# Altium project ESP32_LED_Matrix_Heirarchal.PrjPcb
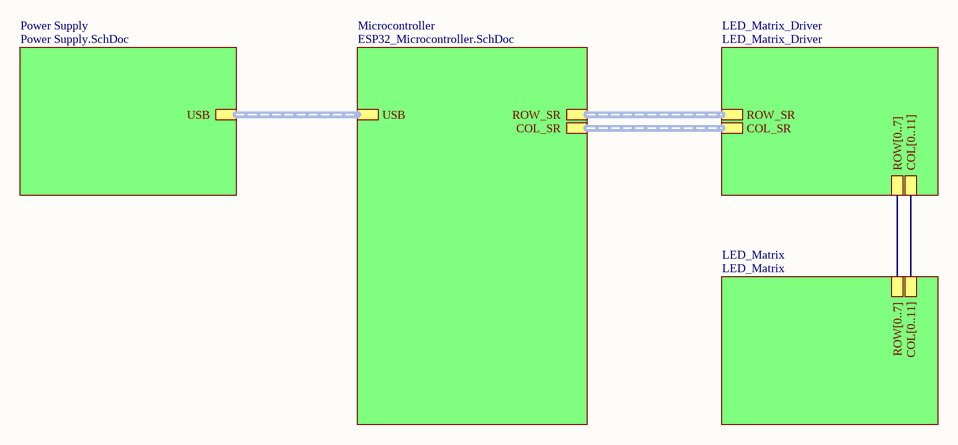
[diagram p0: ESP32_LED_Matrix.SchDoc]
3 sheets, 28 parts. Net scope: hierarchical (ports join the sheet entries above them; power ports are global).
Board files: ESP32_LED_Matrix_Completed.PcbDoc, ESP32_LED_Matrix_Partially_Unrouted.PcbDoc, ESP32_LED_Matrix_Unrouted.PcbDoc
Sheets:
  ESP32_LED_Matrix.SchDoc
    Power Supply = Power Supply.SchDoc
    Microcontroller = ESP32_Microcontroller.SchDoc

## Sheet ESP32_LED_Matrix.SchDoc
size A4; SheetNumber: 1; SheetTotal: 5

### Sub-sheets
LED_Matrix = LED_Matrix (file not in this document): COL[0..11], ROW[0..7]
LED_Matrix_Driver = LED_Matrix_Driver (file not in this document): COL_SR (harness COL_SR), ROW_SR (harness ROW_SR), ROW[0..7], COL[0..11]
Microcontroller = ESP32_Microcontroller.SchDoc: COL_SR (harness COL_SR), ROW_SR (harness ROW_SR), USB (harness USB)
Power Supply = Power Supply.SchDoc: USB (harness USB)

### Buses and harness runs
bus sheet LED_Matrix/COL[0..11] = sheet LED_Matrix_Driver/COL[0..11]
bus sheet LED_Matrix/ROW[0..7] = sheet LED_Matrix_Driver/ROW[0..7]
harness sheet LED_Matrix_Driver/COL_SR = sheet Microcontroller/COL_SR
harness sheet LED_Matrix_Driver/ROW_SR = sheet Microcontroller/ROW_SR
harness sheet Microcontroller/USB = sheet Power Supply/USB

## Sheet Power Supply.SchDoc
size A4; SheetNumber: 3; SheetTotal: 5
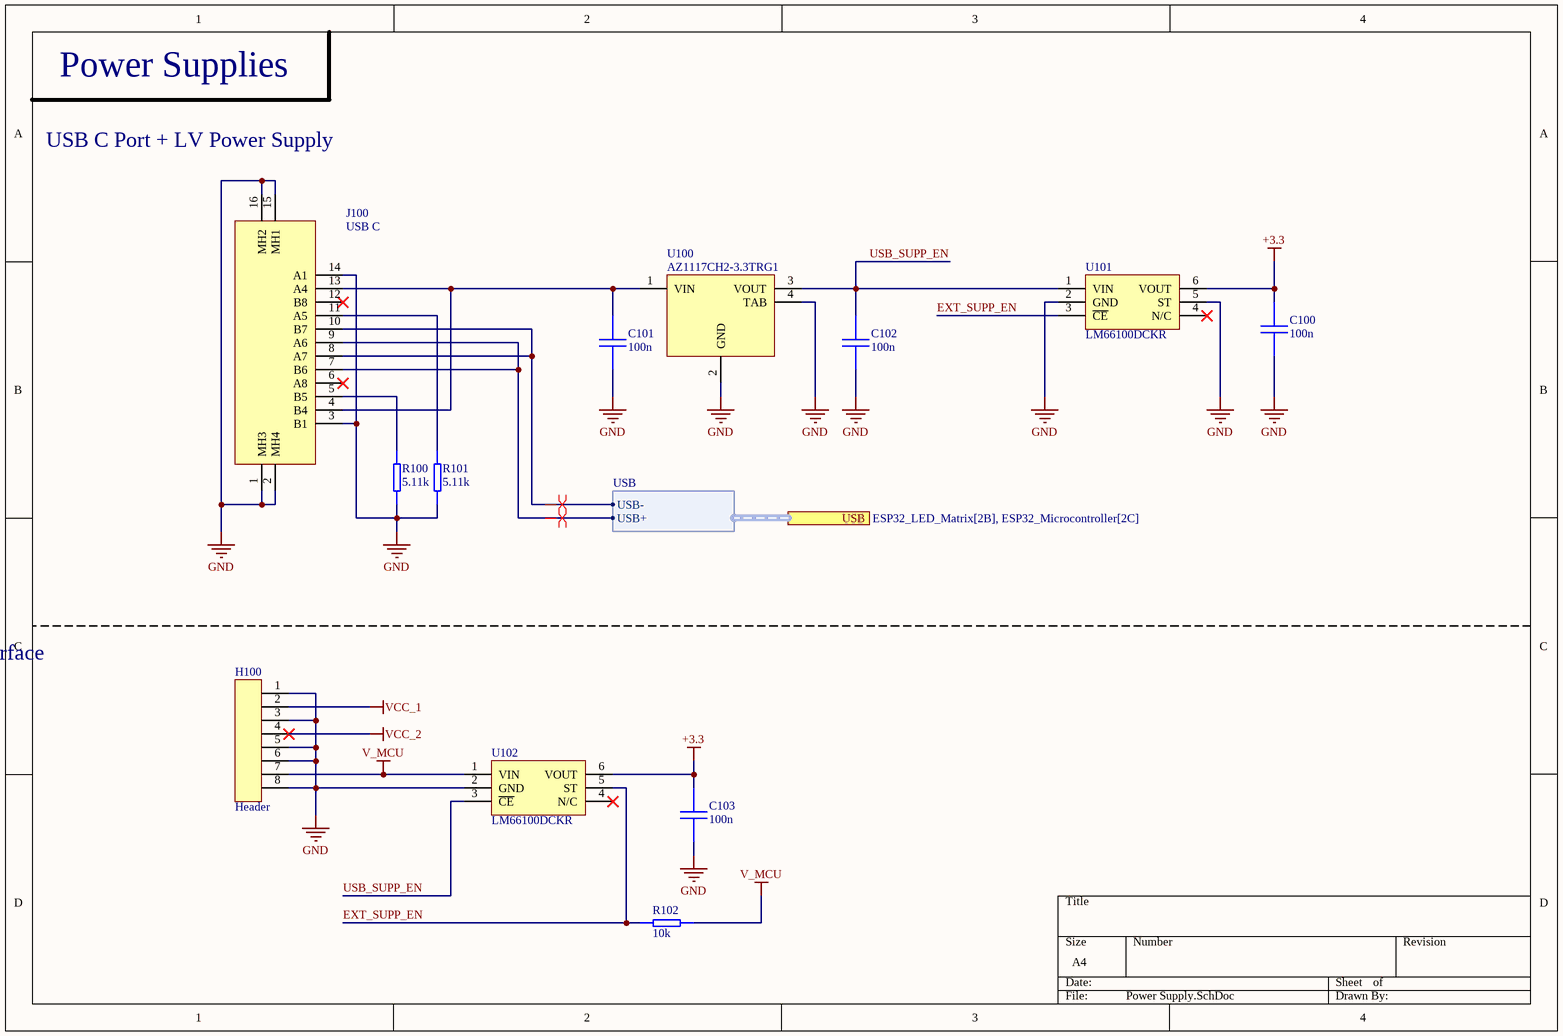
[diagram p1: Power Supply.SchDoc]

### Parts
C100  100n  [CAP0805]
C101  100n  [CAP0805]
C102  100n  [CAP0805]
C103  100n  [CAP0805]
H100  Header  [Header_1X8]
J100  USB C  [USB TYPE C 12 PIN]
R100  5.11k  [RESC0805]
R101  5.11k  [RESC0805]
R102  10k  [RESC0805]
U100  AZ1117CH2-3.3TRG1  [SOT223]
U101  LM66100DCKR  [SC70-6]
U102  LM66100DCKR  [SC70-6]

### Ports
USB (harness USB, see ESP32_LED_Matrix[2B], ESP32_Microcontroller[2C])

### Harnesses
USB: USB-, USB+

### Nets
+3.3: C100.1 C103.1 U101.6(VOUT) U102.6(VOUT)
GND: C100.2 C101.2 C102.2 C103.2 H100.1 H100.3 H100.5 H100.6 H100.8 J100.1(MH3) J100.2(MH4) J100.3(B1) J100.14(A1) J100.15(MH1) J100.16(MH2) R100.1 R101.1 U100.2(GND) U100.4(TAB) U101.2(GND) U101.5(ST) U102.2(GND)
V_MCU: H100.7 R102.2 U102.1(VIN)
VCC_1: H100.2
VCC_2: H100.4
EXT_SUPP_EN: R102.1 U101.3(~{CE}) U102.5(ST)
USB_D_N: J100.8(A7) J100.10(B7) ; port USB.USB-
USB_D_P: J100.7(B6) J100.9(A6) ; port USB.USB+
USB_SUPP_EN: C102.1 U100.3(VOUT) U101.1(VIN) U102.3(~{CE})
NetC101_1: C101.1 J100.4(B4) J100.13(A4) U100.1(VIN)
NetJ100_5: J100.5(B5) R100.2
NetJ100_11: J100.11(A5) R101.2

Not connected (* = marked no-connect by the designer): J100 6(A8)* 12(B8)*; U101 4(N/C)*; U102 4(N/C)*

### Layout directives
differential pair: USB_D_N, USB_D_P

### Notes on the sheet
- Power Supplies
- USB C Port + LV Power Supply
- Power Interface

### Library data of the parts
C100-C103 = Capacitor - Non Polarized: Non Polarized Capacitor
H100 = 8-Pin Header: System: Connector
J100 = USB Type C Connector 12 Pin
R100-R102 = Resistor
U100 = AZ1117CH2-3.3TRG1_1: 3.3V Linear Voltage Regulator
U101 U102 = LM66100DCKR: 5.5-V, 1.5-A 79-mΩ, Low IQ Ideal Diode With Input Polarity Protection; Manufacturer_Name: Texas Instruments; Datasheet Link: http://www.ti.com/lit/gpn/LM66100; Height: 1.1mm; Manufacturer_Part_Number: LM66100DCKR; Mouser Part Number: 595-LM66100DCKR; Mouser Price/Stock: https://www.mouser.co.uk/ProductDetail/Texas-Instruments/LM66100DCKR?qs=vLWxofP3U2y2yPPrXoBBoA%3D%3D; Arrow Part Number: LM66100DCKR; Arrow Price/Stock: https://www.arrow.com/en/products/lm66100dckr/texas-instruments?region=nac

## Sheet ESP32_Microcontroller.SchDoc
size A4; SheetNumber: 2; SheetTotal: 5
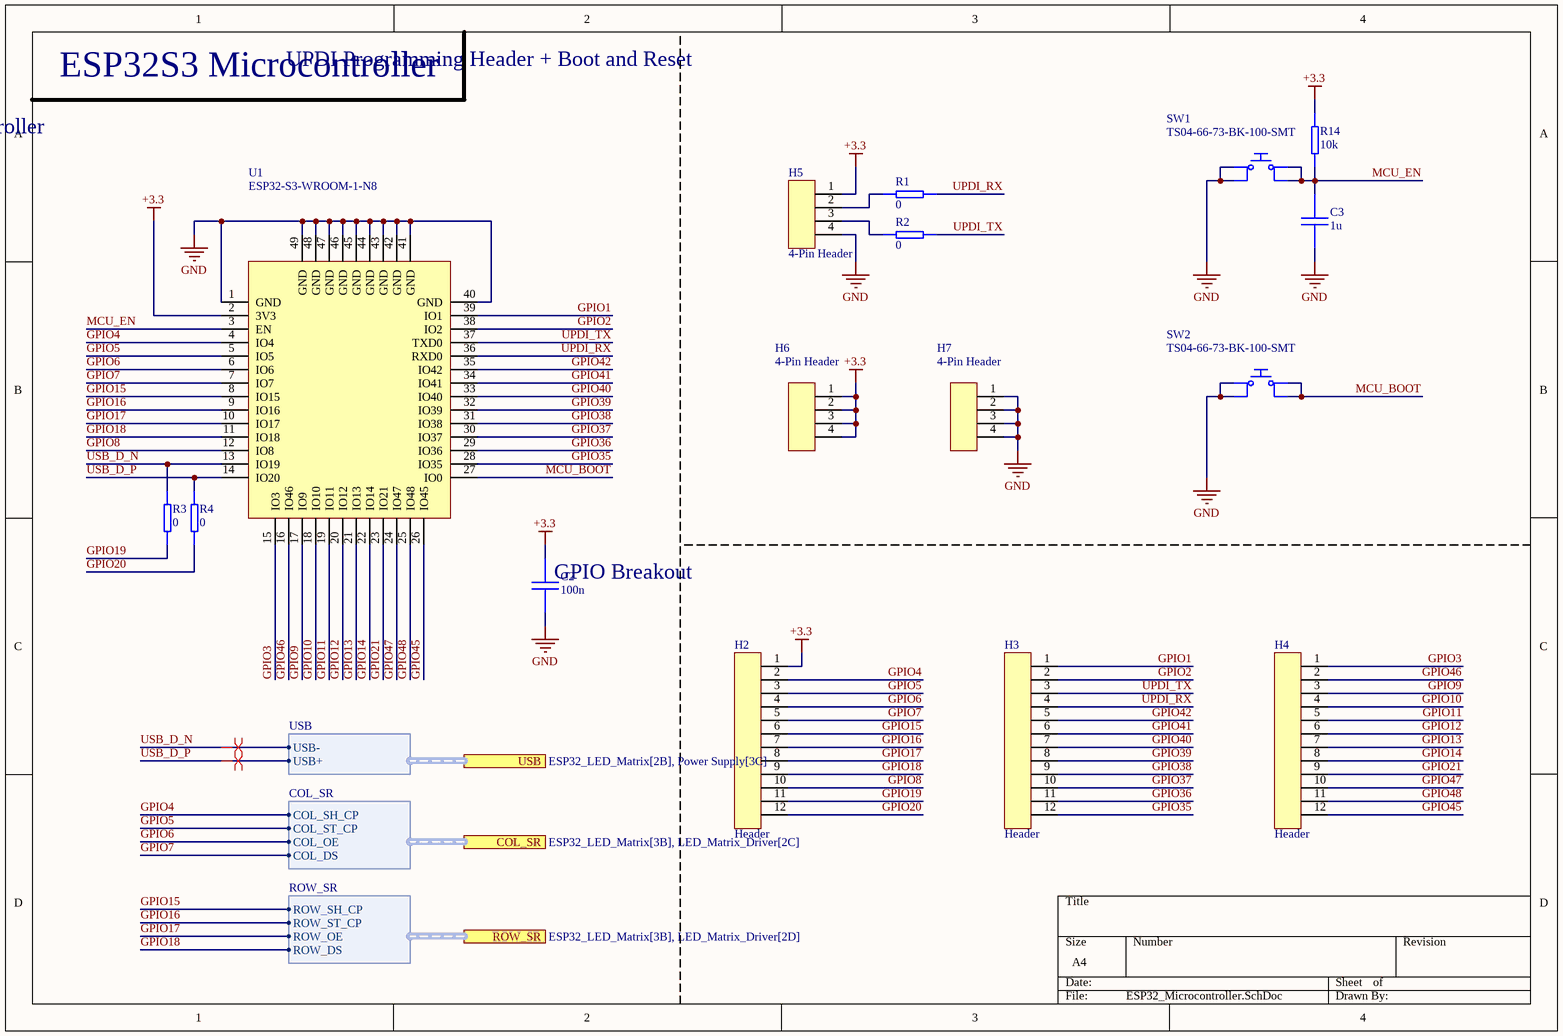
[diagram p2: ESP32_Microcontroller.SchDoc]

### Parts
C2  100n  [CAP0805]
C3  1u  [CAP0805]
H2  Header  [Header_1X12]
H3  Header  [Header_1X12]
H4  Header  [Header_1X12]
H5  4-Pin Header  [Header_1X4]
H6  4-Pin Header  [Header_1X4]
H7  4-Pin Header  [Header_1X4]
R1  0  [RESC0805]
R2  0  [RESC0805]
R3  0  [RESC0805]
R4  0  [RESC0805]
R14  10k  [RESC0805]
SW1  TS04-66-73-BK-100-SMT  [Tactile Button 6.0mm x 6.0mm]
SW2  TS04-66-73-BK-100-SMT  [Tactile Button 6.0mm x 6.0mm]
U1  ESP32-S3-WROOM-1-N8  [ESP32-S3-WROOM-1-N8]

### Ports
COL_SR (harness COL_SR, see ESP32_LED_Matrix[3B], LED_Matrix_Driver[2C]), ROW_SR (harness ROW_SR, see ESP32_LED_Matrix[3B], LED_Matrix_Driver[2D]), USB (harness USB, see ESP32_LED_Matrix[2B], Power Supply[3C])

### Harnesses
COL_SR: COL_SH_CP, COL_ST_CP, COL_OE, COL_DS
ROW_SR: ROW_SH_CP, ROW_ST_CP, ROW_OE, ROW_DS
USB: USB-, USB+

### Nets
+3.3: C2.1 H2.1 H5.1 H6.1 H6.2 H6.3 H6.4 R14.1 U1.2(3V3)
GND: C2.2 C3.2 H5.4 H7.1 H7.2 H7.3 H7.4 SW1.1 SW1.2 SW2.1 SW2.2 U1.1(GND) U1.40(GND) U1.41(GND) U1.42(GND) U1.43(GND) U1.44(GND) U1.45(GND) U1.46(GND) U1.47(GND) U1.48(GND) U1.49(GND)
GPIO1: H3.1 U1.39(IO1)
GPIO2: H3.2 U1.38(IO2)
GPIO3: H4.1 U1.15(IO3)
GPIO4: H2.2 U1.4(IO4) ; port COL_SR.COL_SH_CP
GPIO5: H2.3 U1.5(IO5) ; port COL_SR.COL_ST_CP
GPIO6: H2.4 U1.6(IO6) ; port COL_SR.COL_OE
GPIO7: H2.5 U1.7(IO7) ; port COL_SR.COL_DS
GPIO8: H2.10 U1.12(IO8)
GPIO9: H4.3 U1.17(IO9)
GPIO10: H4.4 U1.18(IO10)
GPIO11: H4.5 U1.19(IO11)
GPIO12: H4.6 U1.20(IO12)
GPIO13: H4.7 U1.21(IO13)
GPIO14: H4.8 U1.22(IO14)
GPIO15: H2.6 U1.8(IO15) ; port ROW_SR.ROW_SH_CP
GPIO16: H2.7 U1.9(IO16) ; port ROW_SR.ROW_ST_CP
GPIO17: H2.8 U1.10(IO17) ; port ROW_SR.ROW_OE
GPIO18: H2.9 U1.11(IO18) ; port ROW_SR.ROW_DS
GPIO19: H2.11 R3.1
GPIO20: H2.12 R4.1
GPIO21: H4.9 U1.23(IO21)
GPIO35: H3.12 U1.28(IO35)
GPIO36: H3.11 U1.29(IO36)
GPIO37: H3.10 U1.30(IO37)
GPIO38: H3.9 U1.31(IO38)
GPIO39: H3.8 U1.32(IO39)
GPIO40: H3.7 U1.33(IO40)
GPIO41: H3.6 U1.34(IO41)
GPIO42: H3.5 U1.35(IO42)
GPIO45: H4.12 U1.26(IO45)
GPIO46: H4.2 U1.16(IO46)
GPIO47: H4.10 U1.24(IO47)
GPIO48: H4.11 U1.25(IO48)
MCU_BOOT: SW2.3 SW2.4 U1.27(IO0)
MCU_EN: C3.1 R14.2 SW1.3 SW1.4 U1.3(EN)
UPDI_RX: H3.4 R1.1 U1.36(RXD0)
UPDI_TX: H3.3 R2.1 U1.37(TXD0)
USB_D_N: R3.2 U1.13(IO19) ; port USB.USB-
USB_D_P: R4.2 U1.14(IO20) ; port USB.USB+
NetH5_2: H5.2 R1.2
NetH5_3: H5.3 R2.2

### Layout directives
differential pair: USB_D_N, USB_D_P

### Notes on the sheet
- ESP32S3 Microcontroller
- UPDI Programming Header + Boot and Reset
- Microcontroller
- GPIO Breakout

### Library data of the parts
C2 C3 = Capacitor - Non Polarized: Non Polarized Capacitor
H2-H4 = 12-Pin Header
R1-R4 R14 = Resistor
SW1 SW2 = TS04-66-73-BK-100-SMT: Switch; Manufacturer_Name: Same Sky; Datasheet Link: https://www.sameskydevices.com/product/resource/supplyframepdf/ts04.pdf; Height: 7.6mm; Manufacturer_Part_Number: TS04-66-73-BK-100-SMT; Mouser Part Number: 179-TS046673BK100SMT; Mouser Price/Stock: https://www.mouser.co.uk/ProductDetail/Same-Sky/TS04-66-73-BK-100-SMT?qs=A6eO%252BMLsxmRAmp3wqRUzZw%3D%3D; Arrow Part Number: TS04-66-73-BK-100-SMT; Arrow Price/Stock: https://www.arrow.com/en/products/ts04-66-73-bk-100-smt/cui-devices?utm_currency=USD&region=nac
U1 = ESP32-S3-WROOM-1-N8: ESP32 Microcontroller with Bluetooth and Wifi

## Nets that join several sheets
+3.3: Power Supply (C100.1 C103.1 U101.6 U102.6), ESP32_Microcontroller (9 pins)
GND: Power Supply (22 pins), ESP32_Microcontroller (22 pins)
USB_D_N: Power Supply (J100.8 J100.10), ESP32_Microcontroller (R3.2 U1.13)
USB_D_P: Power Supply (J100.7 J100.9), ESP32_Microcontroller (R4.2 U1.14)